# Altium project PCB_Project_Smart_Switchboard.PrjPcb
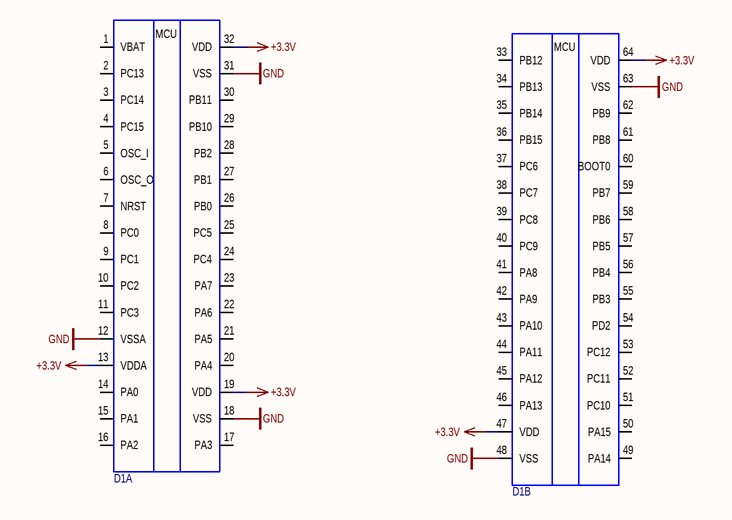
[diagram p0: Sheet_MCU.SchDoc]
4 sheets, 34 parts. Net scope: global (net labels, ports and power ports of the same name join across sheets).
Board file: PCB_Smart_Switchboard.PcbDoc
Sheets:
  Sheet_MCU.SchDoc
  Sheet_ESP8266_SIM800C.SchDoc
  Sheet_Digital_Input_and_Relay.SchDoc
  Sheet_Analog.SchDoc

## Sheet Sheet_MCU.SchDoc
size A4; SheetNumber: 1; SheetTotal: 4

### Parts
D1  STM32f107RCT6  [LQFP-64]  (value not drawn)  (parts A,B of 2)

### Nets
+3.3V: D1.13(VDDA) D1.19(VDD) D1.32(VDD) D1.47(VDD) D1.64(VDD)
GND: D1.12(VSSA) D1.18(VSS) D1.31(VSS) D1.48(VSS) D1.63(VSS)

Not connected (* = marked no-connect by the designer): D1 1(VBAT) 2(PC13) 3(PC14) 4(PC15) 5(OSC_I) 6(OSC_O) 7(NRST) 8(PC0) 9(PC1) 10(PC2) 11(PC3) 14(PA0) 15(PA1) 16(PA2) 17(PA3) 20(PA4) 21(PA5) 22(PA6) 23(PA7) 24(PC4) 25(PC5) 26(PB0) 27(PB1) 28(PB2) 29(PB10) 30(PB11) 33(PB12) 34(PB13) 35(PB14) 36(PB15) 37(PC6) 38(PC7) 39(PC8) 40(PC9) 41(PA8) 42(PA9) 43(PA10) 44(PA11) 45(PA12) 46(PA13) 49(PA14) 50(PA15) 51(PC10) 52(PC11) 53(PC12) 54(PD2) 55(PB3) 56(PB4) 57(PB5) 58(PB6) 59(PB7) 60(BOOT0) 61(PB8) 62(PB9)

### Notes on the sheet
- THIS DOCUMENT AND THE DATA DISCLOSED HEREIN OR
- HEREWITH IS THE PROPERTY OF ALTIUM LIMITED AND MAY
- DWG NO:
- REVISION
- REV:
- DESCRIPTION
- DATE
- APPROVED
- BE FREELY DISTRIBUTED IN WHOLE. NO RIGHTS ARE
- RESERVED OR EXPRESS OR IMPLIED WARANTEE GIVEN.
- ENG:
- APPROVALS
- PROJECT
- DSN:
- CHK:
- REFERENCE DOCUMENTS
- PROJECT REVISION:
- TITLE
- DOCUMENT REVISION:
- DESIGN ITEM:
- BOM:
- FAB DWG:
- PCB DWG:
- ASSY DWG:
- SCALE:
- A3
- SIZE
- CAGE CODE
- FILE NAME
- DWG NO.
- SHEET
- OF
- REV
- (in symbol STM32f107RCT6, part A) MCU
- (in symbol STM32f107RCT6, part B) MCU

### Library data of the parts
D1 = STM32f107RCT6: Manufacturer 1: STMicroelectronics; Manufacturer Part Number 1: STM32F107RCT6

## Sheet Sheet_ESP8266_SIM800C.SchDoc
size A4; SheetNumber: 2; SheetTotal: 4
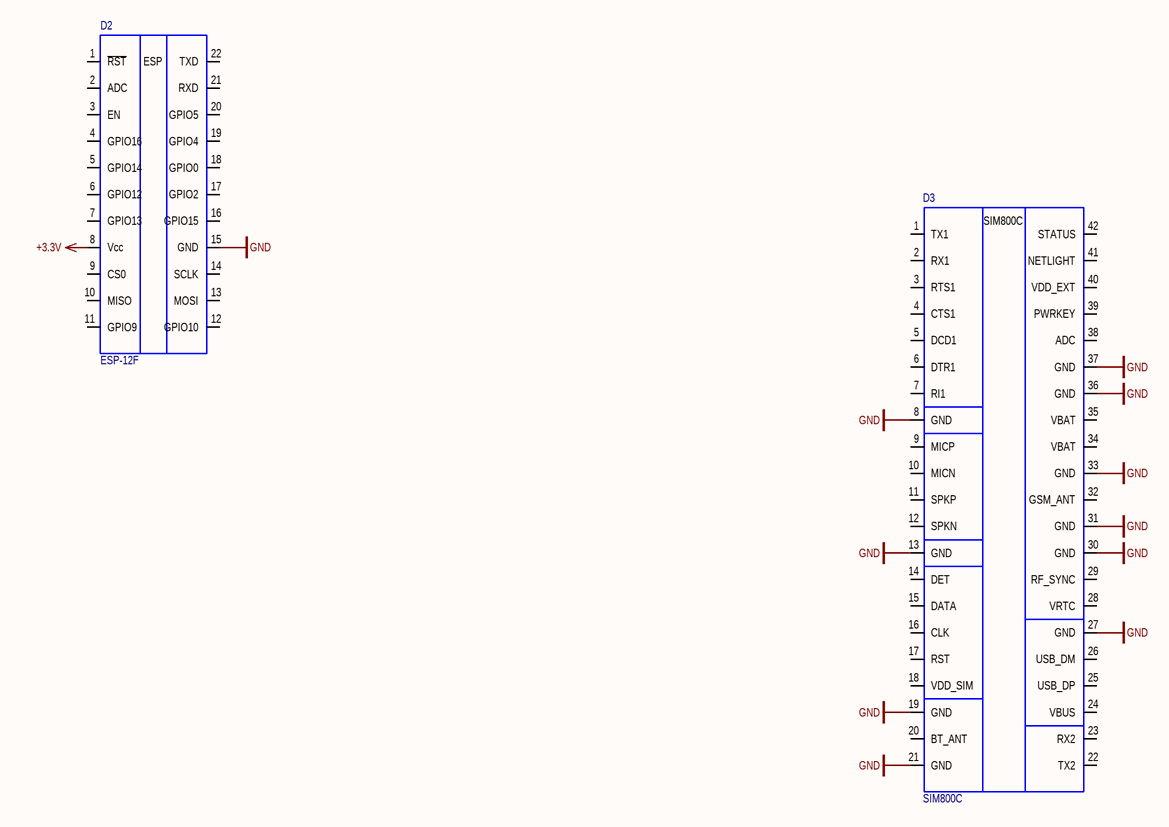
[diagram p1: Sheet_ESP8266_SIM800C.SchDoc]

### Parts
D2  ESP-12F  [ESP8266 ESP-12-E]
D3  SIM800C  [SIM800C]

### Nets
+3.3V: D2.8(Vcc)
GND: D2.15(GND) D3.8(GND) D3.13(GND) D3.19(GND) D3.21(GND) D3.27(GND) D3.30(GND) D3.31(GND) D3.33(GND) D3.36(GND) D3.37(GND)

Not connected (* = marked no-connect by the designer): D2 1(~{RST}) 2(ADC) 3(EN) 4(GPIO16) 5(GPIO14) 6(GPIO12) 7(GPIO13) 9(CS0) 10(MISO) 11(GPIO9) 12(GPIO10) 13(MOSI) 14(SCLK) 16(GPIO15) 17(GPIO2) 18(GPIO0) 19(GPIO4) 20(GPIO5) 21(RXD) 22(TXD); D3 1(TX1) 2(RX1) 3(RTS1) 4(CTS1) 5(DCD1) 6(DTR1) 7(RI1) 9(MICP) 10(MICN) 11(SPKP) 12(SPKN) 14(DET) 15(DATA) 16(CLK) 17(RST) 18(VDD_SIM) 20(BT_ANT) 22(TX2) 23(RX2) 24(VBUS) 25(USB_DP) 26(USB_DM) 28(VRTC) 29(RF_SYNC) 32(GSM_ANT) 34(VBAT) 35(VBAT) 38(ADC) 39(PWRKEY) 40(VDD_EXT) 41(NETLIGHT) 42(STATUS)

### Notes on the sheet
- (in symbol ESP-12F) ESP

## Sheet Sheet_Digital_Input_and_Relay.SchDoc
size A4; SheetNumber: 3; SheetTotal: 4
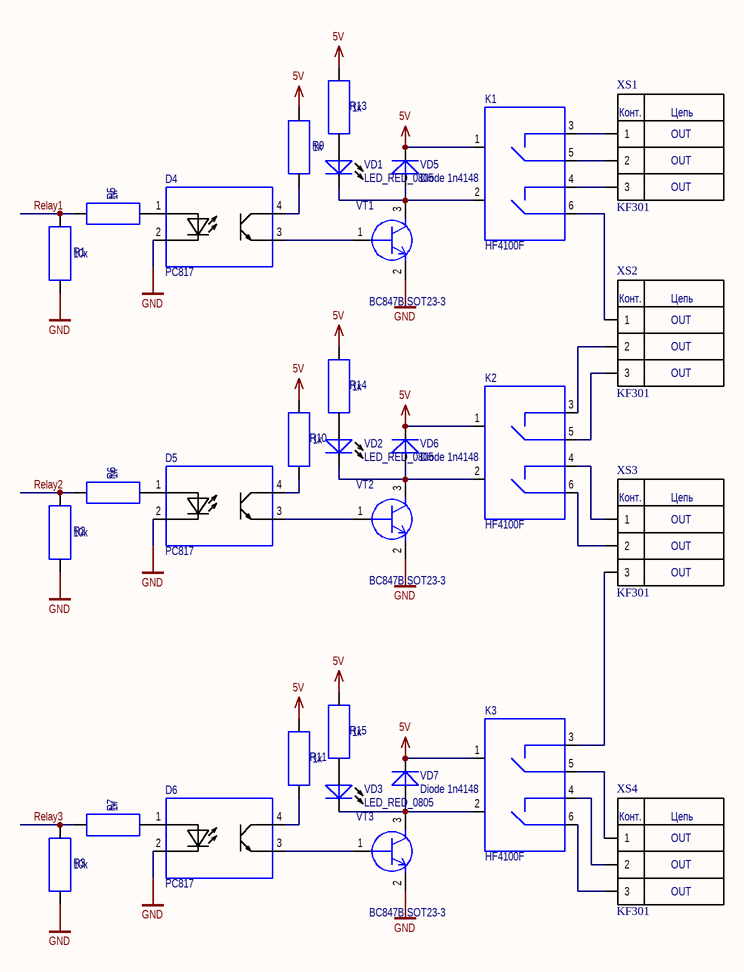
[diagram p2: Sheet_Digital_Input_and_Relay.SchDoc]

### Parts
D4  PC817  [DIP-4]
D5  PC817  [DIP-4]
D6  PC817  [DIP-4]
K1  HF4100F  [HK4100F]
K2  HF4100F  [HK4100F]
K3  HF4100F  [HK4100F]
R1  value 10к  [R0603]  (hidden comment: Resistor)
R2  value 10к  [R0603]  (hidden comment: Resistor)
R3  value 10к  [R0603]  (hidden comment: Resistor)
R5  value 1к  [R0603]  (hidden comment: Resistor)
R6  value 1к  [R0603]  (hidden comment: Resistor)
R7  value 1к  [R0603]  (hidden comment: Resistor)
R9  value 1к  [R0603]  (hidden comment: Resistor)
R10  value 1к  [R0603]  (hidden comment: Resistor)
R11  value 1к  [R0603]  (hidden comment: Resistor)
R13  value 1к  [R0603]  (hidden comment: Resistor)
R14  value 1к  [R0603]  (hidden comment: Resistor)
R15  value 1к  [R0603]  (hidden comment: Resistor)
VD1  LED_RED_0805  [VD0805]
VD2  LED_RED_0805  [VD0805]
VD3  LED_RED_0805  [VD0805]
VD5  Diode 1n4148  [SOD323]
VD6  Diode 1n4148  [SOD323]
VD7  Diode 1n4148  [SOD323]
VT1  BC847B SOT23-3  [INF-SOT23_M]
VT2  BC847B SOT23-3  [INF-SOT23_M]
VT3  BC847B SOT23-3  [INF-SOT23_M]
XS1  KF301  [KF301-5.08-3P]
XS2  KF301  [KF301-5.08-3P]
XS3  KF301  [KF301-5.08-3P]
XS4  KF301  [KF301-5.08-3P]

### Nets
5V: K1.1 K2.1 K3.1 R9.1 R10.1 R11.1 R13.1 R14.1 R15.1 VD5.2 VD6.2 VD7.2
GND: D4.2(Cathode) D5.2(Cathode) D6.2(Cathode) R1.2 R2.2 R3.2 VT1.2(E) VT2.2(E) VT3.2(E)
Relay1: R1.1 R5.1
Relay2: R2.1 R6.1
Relay3: R3.1 R7.1
NetD4_1: D4.1(Anode) R5.2
NetD4_3: D4.3(Emitter) VT1.1(B)
NetD4_4: D4.4(Collector) R9.2
NetD5_1: D5.1(Anode) R6.2
NetD5_3: D5.3(Emitter) VT2.1(B)
NetD5_4: D5.4(Collector) R10.2
NetD6_1: D6.1(Anode) R7.2
NetD6_3: D6.3(Emitter) VT3.1(B)
NetD6_4: D6.4(Collector) R11.2
NetK1_2: K1.2 VD1.2 VD5.1 VT1.3(K)
NetK1_3: K1.3 XS1.1
NetK1_4: K1.4 XS1.3
NetK1_5: K1.5 XS1.2
NetK1_6: K1.6 XS2.1
NetK2_2: K2.2 VD2.2 VD6.1 VT2.3(K)
NetK2_3: K2.3 XS2.2
NetK2_4: K2.4 XS3.1
NetK2_5: K2.5 XS2.3
NetK2_6: K2.6 XS3.2
NetK3_2: K3.2 VD3.2 VD7.1 VT3.3(K)
NetK3_3: K3.3 XS3.3
NetK3_4: K3.4 XS4.2
NetK3_5: K3.5 XS4.1
NetK3_6: K3.6 XS4.3
NetR13_2: R13.2 VD1.1
NetR14_2: R14.2 VD2.1
NetR15_2: R15.2 VD3.1

### Notes on the sheet
- (in symbol KF301) Конт.; Цепь; OUT

### Library data of the parts
D4-D6 = PC817: Manufacturer 1: UMW; Manufacturer Part Number 1: PC817C
R1-R3 = ОСМ Р1-12 -0,1- 10 кОм ± 5%: Manufacturer Part Number 1: RC0603FR-0710K; Manufacturer 1: YAGEO; Tolerance: ± 1% - М; Power: 0,1 Вт; Size: 0603
R5-R7 R9-R11 R13-R15 = ОСМ Р1-12 -0,1- 1 кОм ± 5%: Manufacturer Part Number 1: RC0603JR-071KL; Manufacturer 1: YAGEO; Tolerance: ± 1% - М; Power: 0,1 Вт; TU: АЛЯР.434110.005ТУ, РД В 22.02.218; Size: 0603; HelpURL: Datasheets\Р1-12.pdf
VD1-VD3 = LED_RED_0805: Manufacturer Part Number 1: KPHCM-2012SURCK; Manufacturer 1: Kingbright
VD5-VD7 = Diode 1n4148: Manufacturer Part Number 1: 1N4148WS; Manufacturer 1: Hottech
VT1-VT3 = BC847B SOT23-3: NPN Transistor; Manufacturer 1: Hottech; Part Number: BC847B SOT23-3; CompType: BC847B; Size: SOT23-3; Manufacturer Part Number 1: BC847B
XS1-XS4 = KF301: Manufacturer Part Number 1: KF301-5.0-3P; Manufacturer 1: CIXI SANHE

## Sheet Sheet_Analog.SchDoc
size A4; SheetNumber: 4; SheetTotal: 4

## Nets that join several sheets
+3.3V: Sheet_MCU (5 pins), Sheet_ESP8266_SIM800C (D2.8)
GND: Sheet_MCU (5 pins), Sheet_ESP8266_SIM800C (11 pins), Sheet_Digital_Input_and_Relay (9 pins)